# EAGLE schematic motordriver_4ch (EAGLE 6.5.0)
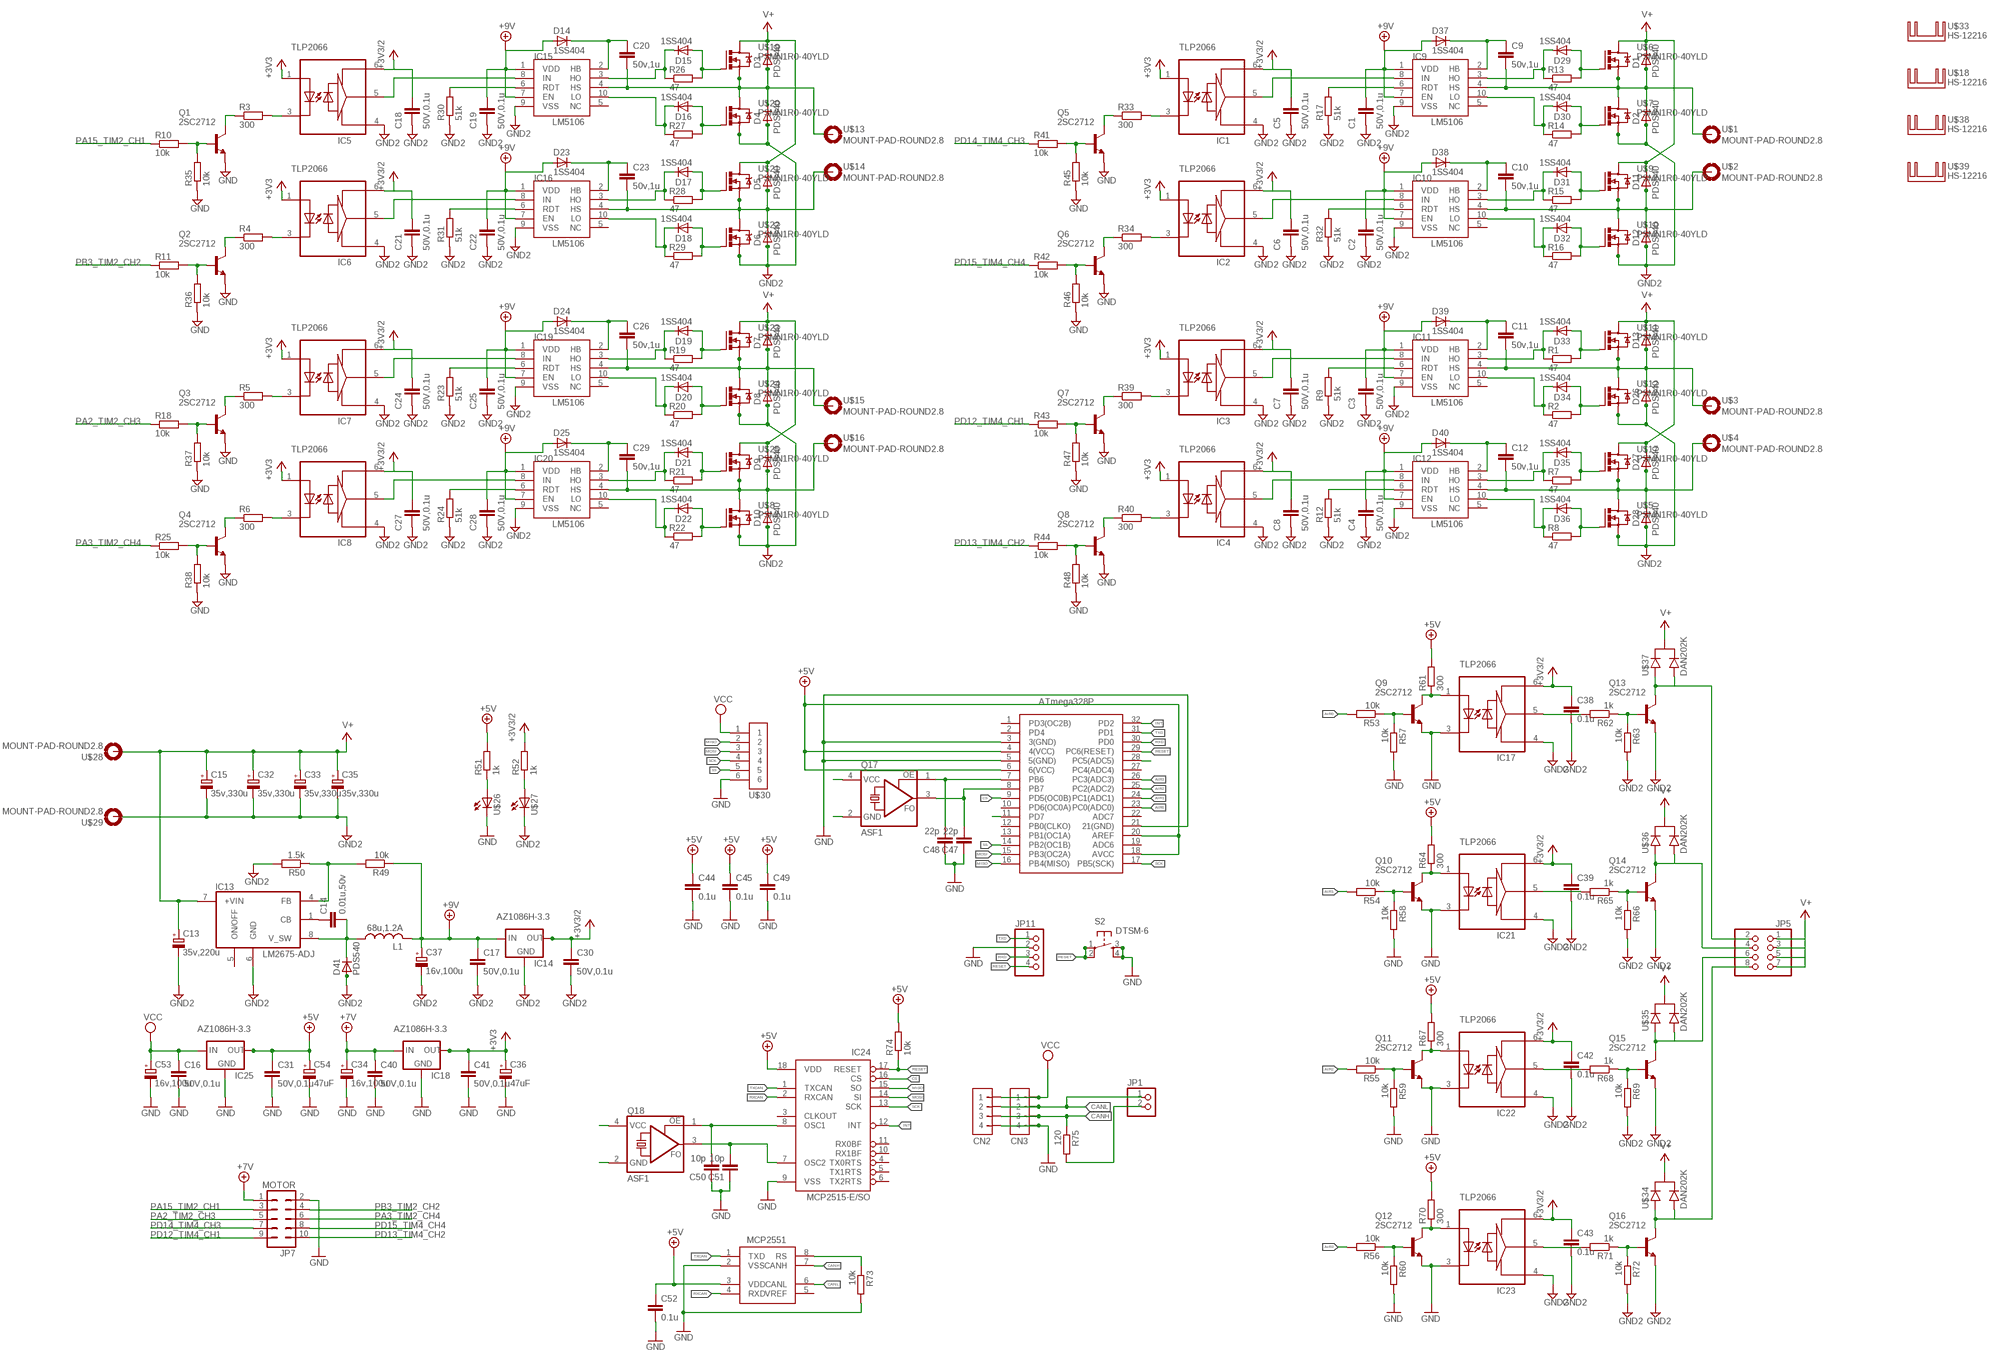
[diagram p0: schematic, sheet 1]

## Parts
C1  50V,0.1u  C-EUC0603  [C0603]
C2  50V,0.1u  C-EUC0603  [C0603]
C3  50V,0.1u  C-EUC0603  [C0603]
C4  50V,0.1u  C-EUC0603  [C0603]
C5  50V,0.1u  C-EUC0603  [C0603]
C6  50V,0.1u  C-EUC0603  [C0603]
C7  50V,0.1u  C-EUC0603  [C0603]
C8  50V,0.1u  C-EUC0603  [C0603]
C9  50v,1u  C-EUC0603  [C0603]
C10  50v,1u  C-EUC0603  [C0603]
C11  50v,1u  C-EUC0603  [C0603]
C12  50v,1u  C-EUC0603  [C0603]
C13  35v,220u  CPOL-EU153CLV-0810  [153CLV-0810]
C14  0.01u,50v  C-EUC0603  [C0603]
C15  35v,330u  CPOL-EU153CLV-1010  [153CLV-1010]
C16  50V,0.1u  C-EUC0603  [C0603]
C17  50V,0.1u  C-EUC0603  [C0603]
C18  50V,0.1u  C-EUC0603  [C0603]
C19  50V,0.1u  C-EUC0603  [C0603]
C20  50v,1u  C-EUC0603  [C0603]
C21  50V,0.1u  C-EUC0603  [C0603]
C22  50V,0.1u  C-EUC0603  [C0603]
C23  50v,1u  C-EUC0603  [C0603]
C24  50V,0.1u  C-EUC0603  [C0603]
C25  50V,0.1u  C-EUC0603  [C0603]
C26  50v,1u  C-EUC0603  [C0603]
C27  50V,0.1u  C-EUC0603  [C0603]
C28  50V,0.1u  C-EUC0603  [C0603]
C29  50v,1u  C-EUC0603  [C0603]
C30  50V,0.1u  C-EUC0603  [C0603]
C31  50V,0.1u  C-EUC0603  [C0603]
C32  35v,330u  CPOL-EU153CLV-1010  [153CLV-1010]
C33  35v,330u  CPOL-EU153CLV-1010  [153CLV-1010]
C34  16v,100u  CPOL-EU153CLV-0605  [153CLV-0605]
C35  35v,330u  CPOL-EU153CLV-1010  [153CLV-1010]
C36  47uF  CPOL-EU153CLV-0405  [153CLV-0405]
C37  16v,100u  CPOL-EU153CLV-0605  [153CLV-0605]
C38  0.1u  C-EUC0603  [C0603]
C39  0.1u  C-EUC0603  [C0603]
C40  50V,0.1u  C-EUC0603  [C0603]
C41  50V,0.1u  C-EUC0603  [C0603]
C42  0.1u  C-EUC0603  [C0603]
C43  0.1u  C-EUC0603  [C0603]
C44  0.1u  C-EUC0603K  [C0603K]
C45  0.1u  C-EUC0603K  [C0603K]
C47  22p  C-EUC0603K  [C0603K]
C48  22p  C-EUC0603K  [C0603K]
C49  0.1u  C-EUC0603K  [C0603K]
C50  10p  C-EUC0603K  [C0603K]
C51  10p  C-EUC0603K  [C0603K]
C52  0.1u  C-EUC0603K  [C0603K]
C53  16v,100u  CPOL-EU153CLV-0605  [153CLV-0605]
C54  47uF  CPOL-EU153CLV-0405  [153CLV-0405]
CN2  CN4-JST-XH-TOP  [JST-B4B-XH-A]
CN3  CN4-JST-XH-TOP  [JST-B4B-XH-A]
D1  PDS540  [POWER_DI_5]
D2  PDS540  [POWER_DI_5]
D3  PDS540  [POWER_DI_5]
D4  PDS540  [POWER_DI_5]
D5  PDS540  [POWER_DI_5]
D6  PDS540  [POWER_DI_5]
D7  PDS540  [POWER_DI_5]
D8  PDS540  [POWER_DI_5]
D9  PDS540  [POWER_DI_5]
D10  PDS540  [POWER_DI_5]
D11  PDS540  [POWER_DI_5]
D12  PDS540  [POWER_DI_5]
D13  PDS540  [POWER_DI_5]
D14  1SS404  [USC(1.25X2.5)]
D15  1SS404  [USC(1.25X2.5)]
D16  1SS404  [USC(1.25X2.5)]
D17  1SS404  [USC(1.25X2.5)]
D18  1SS404  [USC(1.25X2.5)]
D19  1SS404  [USC(1.25X2.5)]
D20  1SS404  [USC(1.25X2.5)]
D21  1SS404  [USC(1.25X2.5)]
D22  1SS404  [USC(1.25X2.5)]
D23  1SS404  [USC(1.25X2.5)]
D24  1SS404  [USC(1.25X2.5)]
D25  1SS404  [USC(1.25X2.5)]
D26  PDS540  [POWER_DI_5]
D27  PDS540  [POWER_DI_5]
D28  PDS540  [POWER_DI_5]
D29  1SS404  [USC(1.25X2.5)]
D30  1SS404  [USC(1.25X2.5)]
D31  1SS404  [USC(1.25X2.5)]
D32  1SS404  [USC(1.25X2.5)]
D33  1SS404  [USC(1.25X2.5)]
D34  1SS404  [USC(1.25X2.5)]
D35  1SS404  [USC(1.25X2.5)]
D36  1SS404  [USC(1.25X2.5)]
D37  1SS404  [USC(1.25X2.5)]
D38  1SS404  [USC(1.25X2.5)]
D39  1SS404  [USC(1.25X2.5)]
D40  1SS404  [USC(1.25X2.5)]
D41  PDS540  [POWER_DI_5]
IC1  TLP117  [MFSOP6]
IC2  TLP117  [MFSOP6]
IC3  TLP117  [MFSOP6]
IC4  TLP117  [MFSOP6]
IC5  TLP117  [MFSOP6]
IC6  TLP117  [MFSOP6]
IC7  TLP117  [MFSOP6]
IC8  TLP117  [MFSOP6]
IC9  LM5106  [MSOP10]
IC10  LM5106  [MSOP10]
IC11  LM5106  [MSOP10]
IC12  LM5106  [MSOP10]
IC13  LM2675-ADJ  LM2675  [SOP8-150]
IC14  LM1117MPX-5.0  LM1117  [SOT223]
IC15  LM5106  [MSOP10]
IC16  LM5106  [MSOP10]
IC17  TLP117  [MFSOP6]
IC18  LM1117MPX-5.0  LM1117  [SOT223]
IC19  LM5106  [MSOP10]
IC20  LM5106  [MSOP10]
IC21  TLP117  [MFSOP6]
IC22  TLP117  [MFSOP6]
IC23  TLP117  [MFSOP6]
IC24  MCP2515-E/SO  [SO18L]
IC25  LM1117MPX-5.0  LM1117  [SOT223]
JP1  PINHD-1X2  [1X02]
JP5  PINHD-2X4/90  [2X04/90]
JP7  MOTOR  ML10L  [ML10L]
JP11  PINHD-1X4  [1X04]
L1  68u,1.2A  SLF10145T  [SLF10145]
Q1  2SC2712  [SC-59(TYPE1)]
Q2  2SC2712  [SC-59(TYPE1)]
Q3  2SC2712  [SC-59(TYPE1)]
Q4  2SC2712  [SC-59(TYPE1)]
Q5  2SC2712  [SC-59(TYPE1)]
Q6  2SC2712  [SC-59(TYPE1)]
Q7  2SC2712  [SC-59(TYPE1)]
Q8  2SC2712  [SC-59(TYPE1)]
Q9  2SC2712  [SC-59(TYPE1)]
Q10  2SC2712  [SC-59(TYPE1)]
Q11  2SC2712  [SC-59(TYPE1)]
Q12  2SC2712  [SC-59(TYPE1)]
Q13  2SC2712  [SC-59(TYPE1)]
Q14  2SC2712  [SC-59(TYPE1)]
Q15  2SC2712  [SC-59(TYPE1)]
Q16  2SC2712  [SC-59(TYPE1)]
Q17  ASF1  [ASF]
Q18  ASF1  [ASF]
R1  47  R-EU_R0603  [R0603]
R2  47  R-EU_R0603  [R0603]
R3  300  R-EU_R0603  [R0603]
R4  300  R-EU_R0603  [R0603]
R5  300  R-EU_R0603  [R0603]
R6  300  R-EU_R0603  [R0603]
R7  47  R-EU_R0603  [R0603]
R8  47  R-EU_R0603  [R0603]
R9  51k  R-EU_R0603  [R0603]
R10  10k  R-EU_R0603  [R0603]
R11  10k  R-EU_R0603  [R0603]
R12  51k  R-EU_R0603  [R0603]
R13  47  R-EU_R0603  [R0603]
R14  47  R-EU_R0603  [R0603]
R15  47  R-EU_R0603  [R0603]
R16  47  R-EU_R0603  [R0603]
R17  51k  R-EU_R0603  [R0603]
R18  10k  R-EU_R0603  [R0603]
R19  47  R-EU_R0603  [R0603]
R20  47  R-EU_R0603  [R0603]
R21  47  R-EU_R0603  [R0603]
R22  47  R-EU_R0603  [R0603]
R23  51k  R-EU_R0603  [R0603]
R24  51k  R-EU_R0603  [R0603]
R25  10k  R-EU_R0603  [R0603]
R26  47  R-EU_R0603  [R0603]
R27  47  R-EU_R0603  [R0603]
R28  47  R-EU_R0603  [R0603]
R29  47  R-EU_R0603  [R0603]
R30  51k  R-EU_R0603  [R0603]
R31  51k  R-EU_R0603  [R0603]
R32  51k  R-EU_R0603  [R0603]
R33  300  R-EU_R0603  [R0603]
R34  300  R-EU_R0603  [R0603]
R35  10k  R-EU_R0603  [R0603]
R36  10k  R-EU_R0603  [R0603]
R37  10k  R-EU_R0603  [R0603]
R38  10k  R-EU_R0603  [R0603]
R39  300  R-EU_R0603  [R0603]
R40  300  R-EU_R0603  [R0603]
R41  10k  R-EU_R0603  [R0603]
R42  10k  R-EU_R0603  [R0603]
R43  10k  R-EU_R0603  [R0603]
R44  10k  R-EU_R0603  [R0603]
R45  10k  R-EU_R0603  [R0603]
R46  10k  R-EU_R0603  [R0603]
R47  10k  R-EU_R0603  [R0603]
R48  10k  R-EU_R0603  [R0603]
R49  10k  R-EU_R0603  [R0603]
R50  1.5k  R-EU_R0603  [R0603]
R51  1k  R-EU_R0603  [R0603]
R52  1k  R-EU_R0603  [R0603]
R53  10k  R-EU_R0603  [R0603]
R54  10k  R-EU_R0603  [R0603]
R55  10k  R-EU_R0603  [R0603]
R56  10k  R-EU_R0603  [R0603]
R57  10k  R-EU_R0603  [R0603]
R58  10k  R-EU_R0603  [R0603]
R59  10k  R-EU_R0603  [R0603]
R60  10k  R-EU_R0603  [R0603]
R61  300  R-EU_R0603  [R0603]
R62  1k  R-EU_R0603  [R0603]
R63  10k  R-EU_R0603  [R0603]
R64  300  R-EU_R0603  [R0603]
R65  1k  R-EU_R0603  [R0603]
R66  10k  R-EU_R0603  [R0603]
R67  300  R-EU_R0603  [R0603]
R68  1k  R-EU_R0603  [R0603]
R69  10k  R-EU_R0603  [R0603]
R70  300  R-EU_R0603  [R0603]
R71  1k  R-EU_R0603  [R0603]
R72  10k  R-EU_R0603  [R0603]
R73  10k  R-EU_R0603  [R0603]
R74  10k  R-EU_R0603  [R0603]
R75  120  R-EU_R0603  [R0603]
S2  DTSM-6  [DTSM-6]
U$1  MOUNT-PAD-ROUND2.8  [2,8-PAD]
U$2  MOUNT-PAD-ROUND2.8  [2,8-PAD]
U$3  MOUNT-PAD-ROUND2.8  [2,8-PAD]
U$4  MOUNT-PAD-ROUND2.8  [2,8-PAD]
U$5  PSMN1R0-40YLD  [LFPAK56]
U$6  PSMN1R0-40YLD  [LFPAK56]
U$7  PSMN1R0-40YLD  [LFPAK56]
U$8  PSMN1R0-40YLD  [LFPAK56]
U$9  PSMN1R0-40YLD  [LFPAK56]
U$10  PSMN1R0-40YLD  [LFPAK56]
U$11  PSMN1R0-40YLD  [LFPAK56]
U$12  PSMN1R0-40YLD  [LFPAK56]
U$13  MOUNT-PAD-ROUND2.8  [2,8-PAD]
U$14  MOUNT-PAD-ROUND2.8  [2,8-PAD]
U$15  MOUNT-PAD-ROUND2.8  [2,8-PAD]
U$16  MOUNT-PAD-ROUND2.8  [2,8-PAD]
U$17  PSMN1R0-40YLD  [LFPAK56]
U$18  HS-12216  [HS-12216]
U$19  PSMN1R0-40YLD  [LFPAK56]
U$20  PSMN1R0-40YLD  [LFPAK56]
U$21  PSMN1R0-40YLD  [LFPAK56]
U$22  PSMN1R0-40YLD  [LFPAK56]
U$23  PSMN1R0-40YLD  [LFPAK56]
U$24  PSMN1R0-40YLD  [LFPAK56]
U$25  PSMN1R0-40YLD  [LFPAK56]
U$26  0603  [0603]
U$27  0603  [0603]
U$28  MOUNT-PAD-ROUND2.8  [2,8-PAD]
U$29  MOUNT-PAD-ROUND2.8  [2,8-PAD]
U$30  CN6  [JST-B6B-XH-A]
U$31  ATMEGA328P  [TQFP]
U$32  MCP2551  [SOIC]
U$33  HS-12216  [HS-12216]
U$34  DAN202K  [SC-59]
U$35  DAN202K  [SC-59]
U$36  DAN202K  [SC-59]
U$37  DAN202K  [SC-59]
U$38  HS-12216  [HS-12216]
U$39  HS-12216  [HS-12216]

## Nets
3V3/2: C5.1 C6.1 C7.1 C8.1 C18.1 C21.1 C24.1 C27.1 C30.1 C38.1 C39.1 C42.1 C43.1 IC1.6(VCC) IC2.6(VCC) IC3.6(VCC) IC4.6(VCC) IC5.6(VCC) IC6.6(VCC) IC7.6(VCC) IC8.6(VCC) IC14.2(OUT1) IC14.4(OUT) IC17.6(VCC) IC21.6(VCC) IC22.6(VCC) IC23.6(VCC) R52.2 ; supply symbol labelled +3V3/2
+3V3: C36.+ C41.1 IC1.1 IC2.1 IC3.1 IC4.1 IC5.1 IC6.1 IC7.1 IC8.1 IC18.2(OUT1) IC18.4(OUT) ; supply symbol labelled +3V3/2
+5V: C31.1 C44.1 C45.1 C49.1 C52.1 C54.+ IC24.18(VDD) IC25.2(OUT1) IC25.4(OUT) R51.2 R61.2 R64.2 R67.2 R70.2 R74.2 U$31.4(4(VCC)) U$31.6(6(VCC)) U$31.18(AVCC) U$31.20(AREF) U$32.3(VDD)
+7V [VCC]: C34.+ C40.1 IC18.3(IN) JP7.1
+9V: C1.1 C2.1 C3.1 C4.1 C17.1 C19.1 C22.1 C25.1 C28.1 C37.+ D14.A D23.A D24.A D25.A D37.A D38.A D39.A D40.A IC9.1(VDD) IC9.7(EN) IC10.1(VDD) IC10.7(EN) IC11.1(VDD) IC11.7(EN) IC12.1(VDD) IC12.7(EN) IC14.3(IN) IC15.1(VDD) IC15.7(EN) IC16.1(VDD) IC16.7(EN) IC19.1(VDD) IC19.7(EN) IC20.1(VDD) IC20.7(EN) L1.P$2 R49.1
AIR0: R53.2 U$31.23(PC0(ADC0))
AIR1: R54.2 U$31.24(PC1(ADC1))
AIR2: R55.2 U$31.25(PC2(ADC2))
AIR3: R56.2 U$31.26(PC3(ADC3))
AIR5: U$31.28(PC5(ADC5))
CANH: CN2.3 CN3.3 R75.1 U$32.7(CANH)
CANL: CN2.2 CN3.2 JP1.1 U$32.6(CANL)
CS: IC24.16(CS) U$31.9(PD5(OC0B))
GND: C16.2 C31.2 C34.- C36.- C40.2 C41.2 C44.2 C45.2 C47.1 C48.1 C49.2 C50.1 C51.1 C52.2 C53.- C54.- CN2.4 CN3.4 IC17.3 IC18.1(GND) IC21.3 IC22.3 IC23.3 IC24.9(VSS) IC25.1(GND) JP7.2 JP11.2 Q1.E Q2.E Q3.E Q4.E Q5.E Q6.E Q7.E Q8.E Q9.E Q10.E Q11.E Q12.E R35.1 R36.1 R37.1 R38.1 R45.1 R46.1 R47.1 R48.1 R57.2 R58.2 R59.2 R60.2 R73.2 S2.3 S2.4 U$26.C U$30.6 U$31.3(3(GND)) U$31.5(5(GND)) U$31.21(21(GND)) U$32.2(VSS)
GND2: C1.2 C2.2 C3.2 C4.2 C5.2 C6.2 C7.2 C8.2 C13.- C15.- C17.2 C18.2 C19.2 C21.2 C22.2 C24.2 C25.2 C27.2 C28.2 C30.2 C32.- C33.- C35.- C37.- C38.2 C39.2 C42.2 C43.2 D2.A1 D2.A2(A) D4.A1 D4.A2(A) D6.A1 D6.A2(A) D8.A1 D8.A2(A) D10.A1 D10.A2(A) D12.A1 D12.A2(A) D26.A1 D26.A2(A) D28.A1 D28.A2(A) D41.A1 D41.A2(A) IC1.4(GND) IC2.4(GND) IC3.4(GND) IC4.4(GND) IC5.4(GND) IC6.4(GND) IC7.4(GND) IC8.4(GND) IC9.9(VSS) IC10.9(VSS) IC11.9(VSS) IC12.9(VSS) IC13.6(GND) IC14.1(GND) IC15.9(VSS) IC16.9(VSS) IC17.4(GND) IC19.9(VSS) IC20.9(VSS) IC21.4(GND) IC22.4(GND) IC23.4(GND) Q13.E Q14.E Q15.E Q16.E R9.1 R12.1 R17.1 R23.1 R24.1 R30.1 R31.1 R32.1 R50.2 R63.2 R66.2 R69.2 R72.2 U$5.1(S) U$5.2(S) U$5.3(S) U$7.1(S) U$7.2(S) U$7.3(S) U$8.1(S) U$8.2(S) U$8.3(S) U$10.1(S) U$10.2(S) U$10.3(S) U$12.1(S) U$12.2(S) U$12.3(S) U$20.1(S) U$20.2(S) U$20.3(S) U$22.1(S) U$22.2(S) U$22.3(S) U$24.1(S) U$24.2(S) U$24.3(S) U$27.C U$29.B2,8(MOUNT)
INT: IC24.12(INT) U$31.32(PD2)
MISO: IC24.15(SO) U$30.2 U$31.16(PB4(MISO))
MOSI: IC24.14(SI) U$30.3 U$31.15(PB3(OC2A))
N$1: C11.2 D13.A1 D13.A2(A) D26.K(C) IC11.4(HS) U$3.B2,8(MOUNT) U$11.1(S) U$11.2(S) U$11.3(S) U$12.5(D)
N$2: D33.A R1.2 U$11.4(G)
N$3: Q1.C R3.1
N$4: D34.A R2.2 U$12.4(G)
N$5: D36.A R8.2 U$5.4(G)
N$6: D35.A R7.2 U$17.4(G)
N$7: D33.K(C) IC11.3(HO) R1.1
N$8: D34.K(C) IC11.10(LO) R2.1
N$9: D35.K(C) IC12.3(HO) R7.1
N$10: D36.K(C) IC12.10(LO) R8.1
N$11: IC12.6(RDT) R12.2
N$12: IC5.5 IC15.8(IN)
N$13: IC6.5 IC16.8(IN)
N$14: C11.1 D39.K(C) IC11.2(HB)
N$15: C12.1 D40.K(C) IC12.2(HB)
N$16: IC7.5 IC19.8(IN)
N$17: C12.2 D27.A1 D27.A2(A) D28.K(C) IC12.4(HS) U$4.B2,8(MOUNT) U$5.5(D) U$17.1(S) U$17.2(S) U$17.3(S)
N$18: IC11.6(RDT) R9.2
N$19: IC8.5 IC20.8(IN)
N$20: C9.2 D1.A1 D1.A2(A) D2.K(C) IC9.4(HS) U$1.B2,8(MOUNT) U$6.1(S) U$6.2(S) U$6.3(S) U$7.5(D)
N$21: D29.A R13.2 U$6.4(G)
N$22: D30.A R14.2 U$7.4(G)
N$23: D32.A R16.2 U$10.4(G)
N$24: D31.A R15.2 U$9.4(G)
N$25: D29.K(C) IC9.3(HO) R13.1
N$26: D30.K(C) IC9.10(LO) R14.1
N$27: D31.K(C) IC10.3(HO) R15.1
N$28: D32.K(C) IC10.10(LO) R16.1
N$29: IC10.6(RDT) R32.2
N$30: C9.1 D37.K(C) IC9.2(HB)
N$31: C10.1 D38.K(C) IC10.2(HB)
N$32: IC9.6(RDT) R17.2
N$33: C10.2 D11.A1 D11.A2(A) D12.K(C) IC10.4(HS) U$2.B2,8(MOUNT) U$9.1(S) U$9.2(S) U$9.3(S) U$10.5(D)
N$34: IC1.5 IC9.8(IN)
N$35: IC2.5 IC10.8(IN)
N$36: IC3.5 IC11.8(IN)
N$37: IC4.5 IC12.8(IN)
N$38: Q5.C R33.1
N$39: IC1.3 R33.2
N$40: IC2.3 R34.2
N$41: Q6.C R34.1
N$42: IC3.3 R39.2
N$43: Q7.C R39.1
N$44: C26.2 D7.A1 D7.A2(A) D8.K(C) IC19.4(HS) U$15.B2,8(MOUNT) U$23.1(S) U$23.2(S) U$23.3(S) U$24.5(D)
N$45: IC4.3 R40.2
N$46: D19.A R19.2 U$23.4(G)
N$47: D20.A R20.2 U$24.4(G)
N$48: D22.A R22.2 U$8.4(G)
N$49: D21.A R21.2 U$25.4(G)
N$50: D19.K(C) IC19.3(HO) R19.1
N$51: D20.K(C) IC19.10(LO) R20.1
N$52: D21.K(C) IC20.3(HO) R21.1
N$53: D22.K(C) IC20.10(LO) R22.1
N$54: Q8.C R40.1
N$55: IC20.6(RDT) R24.2
N$56: Q5.B R41.2 R45.2
N$57: C26.1 D24.K(C) IC19.2(HB)
N$58: C29.1 D25.K(C) IC20.2(HB)
N$59: C29.2 D9.A1 D9.A2(A) D10.K(C) IC20.4(HS) U$8.5(D) U$16.B2,8(MOUNT) U$25.1(S) U$25.2(S) U$25.3(S)
N$60: Q6.B R42.2 R46.2
N$61: IC19.6(RDT) R23.2
N$62: C20.2 D3.A1 D3.A2(A) D4.K(C) IC15.4(HS) U$13.B2,8(MOUNT) U$19.1(S) U$19.2(S) U$19.3(S) U$20.5(D)
N$63: C23.2 D5.A1 D5.A2(A) D6.K(C) IC16.4(HS) U$14.B2,8(MOUNT) U$21.1(S) U$21.2(S) U$21.3(S) U$22.5(D)
N$64: D15.A R26.2 U$19.4(G)
N$65: D16.A R27.2 U$20.4(G)
N$66: D18.A R29.2 U$22.4(G)
N$67: D17.A R28.2 U$21.4(G)
N$68: D15.K(C) IC15.3(HO) R26.1
N$69: D16.K(C) IC15.10(LO) R27.1
N$70: D17.K(C) IC16.3(HO) R28.1
N$71: D18.K(C) IC16.10(LO) R29.1
N$72: Q7.B R43.2 R47.2
N$73: IC16.6(RDT) R31.2
N$74: Q8.B R44.2 R48.2
N$75: C20.1 D14.K(C) IC15.2(HB)
N$76: C23.1 D23.K(C) IC16.2(HB)
N$77: IC13.4(FB) R49.2 R50.1
N$78: R51.1 U$26.A
N$79: IC15.6(RDT) R30.2
N$80: IC5.3 R3.2
N$81: IC6.3 R4.2
N$82: Q2.C R4.1
N$83: C14.2 D41.K(C) IC13.8(V_SW) L1.P$1
N$84: IC7.3 R5.2
N$85: R52.1 U$27.A
N$86: C14.1 IC13.1(CB)
N$87: Q9.B R53.1 R57.1
N$88: Q10.B R54.1 R58.1
N$89: Q11.B R55.1 R59.1
N$90: Q12.B R56.1 R60.1
N$91: IC17.1 Q9.C R61.1
N$92: IC17.5 R62.2
N$93: Q3.C R5.1
N$94: IC8.3 R6.2
N$95: Q13.B R62.1 R63.1
N$96: JP5.2 Q13.C U$37.A@1(A1) U$37.A@2(A2)
N$97: IC21.5 R65.2
N$98: IC22.5 R68.2
N$99: IC23.5 R71.2
N$100: IC21.1 Q10.C R64.1
N$101: Q14.B R65.1 R66.1
N$102: JP5.4 Q14.C U$36.A@1(A1) U$36.A@2(A2)
N$103: Q4.C R6.1
N$104: IC22.1 Q11.C R67.1
N$105: Q15.B R68.1 R69.1
N$106: JP5.6 Q15.C U$35.A@1(A1) U$35.A@2(A2)
N$107: IC23.1 Q12.C R70.1
N$108: JP5.8 Q16.C U$34.A@1(A1) U$34.A@2(A2)
N$109: Q16.B R71.1 R72.1
N$110: C47.2 Q17.3(FO) U$31.8(PB7)
N$111: C48.2 Q17.1(OE) U$31.7(PB6)
N$112: R73.1 U$32.8(RS)
N$113: C50.2 IC24.8(OSC1) Q18.1(OE)
N$114: C51.2 IC24.7(OSC2) Q18.3(FO)
N$115: Q1.B R10.2 R35.2
N$116: Q2.B R11.2 R36.2
N$117: Q3.B R18.2 R37.2
N$118: Q4.B R25.2 R38.2
N$119: Q18.4(VCC)
N$120: Q18.2(GND)
N$121: JP1.2 R75.2
N$122: Q17.2(GND)
N$129: Q17.4(VCC)
PA2_TIM2_CH3: JP7.5 R18.1
PA3_TIM2_CH4: JP7.6 R25.1
PA15_TIM2_CH1: JP7.3 R10.1
PB3_TIM2_CH2: JP7.4 R11.1
PD12_TIM4_CH1: JP7.9 R43.1
PD13_TIM4_CH2: JP7.10 R44.1
PD14_TIM4_CH3: JP7.7 R41.1
PD15_TIM4_CH4: JP7.8 R42.1
RESET: IC24.17(RESET) JP11.4 R74.1 S2.1 S2.2 U$31.29(PC6(RESET))
RXCAN: IC24.2(RXCAN) U$32.4(RXD)
RXD: JP11.3 U$31.30(PD0)
SCK: IC24.13(SCK) U$30.4 U$31.17(PB5(SCK))
SS: U$30.5 U$31.14(PB2(OC1B))
SW2: U$31.11(PD7)
TXCAN: IC24.1(TXCAN) U$32.1(TXD)
TXD: JP11.1 U$31.31(PD1)
V+: C13.+ C15.+ C32.+ C33.+ C35.+ D1.K(C) D3.K(C) D5.K(C) D7.K(C) D9.K(C) D11.K(C) D13.K(C) D27.K(C) IC13.7(+VIN) JP5.1 JP5.3 JP5.5 JP5.7 U$6.5(D) U$9.5(D) U$11.5(D) U$17.5(D) U$19.5(D) U$21.5(D) U$23.5(D) U$25.5(D) U$28.B2,8(MOUNT) U$34.K U$35.K U$36.K U$37.K
VCC [VCC]: C16.1 C53.+ CN2.1 CN3.1 IC25.3(IN) U$30.1
Unconnected: IC9.5(NC) IC10.5(NC) IC11.5(NC) IC12.5(NC) IC13.5(ON/OFF) IC15.5(NC) IC16.5(NC) IC19.5(NC) IC20.5(NC) IC24.3(CLKOUT) IC24.4(TX0RTS) IC24.5(TX1RTS) IC24.6(TX2RTS) IC24.10(RX1BF) IC24.11(RX0BF) U$31.1(PD3(OC2B)) U$31.2(PD4) U$31.10(PD6(OC0A)) U$31.12(PB0(CLKO)) U$31.13(PB1(OC1A)) U$31.19(ADC6) U$31.22(ADC7) U$31.27(PC4(ADC4)) U$32.5(VREF)

## Notes on the sheet
- TLP2066 | TLP2066
- TLP2066 | TLP2066
- TLP2066 | TLP2066
- TLP2066 | TLP2066
- TLP2066
- TLP2066
- AZ1086H-3.3
- TLP2066
- AZ1086H-3.3 | AZ1086H-3.3
- TLP2066

## Library data of the parts
C1-C12 C14 C16-C31 C38-C45 C47-C52 = rcl:C-EU: CAPACITOR, European symbol
C13 C15 C32-C37 C53 C54 = rcl:CPOL-EU: POLARIZED CAPACITOR, European symbol
CN2 CN3 = con-jst_xh:CN4: Connector 4 circuits
D1-D13 D26-D28 D41 = Diode:PDS540
D14-D25 D29-D40 = Diode:1SS404
IC1-IC8 IC17 IC21-IC23 = PhotoCoupler:TLP117
IC9-IC12 IC15 IC16 IC19 IC20 = MotorDrivex:LM5106
IC13 = SwitchingRegulator:LM2675
IC14 IC18 IC25 = VoltageRegulator:LM1117
IC24 = mcp2515:MCP2515
JP1 = pinhead:PINHD-1X2: PIN HEADER
JP5 = pinhead:PINHD-2X4: PIN HEADER
JP7 = MIL-Conector:ML10L: HARTING
JP11 = pinhead:PINHD-1X4: PIN HEADER
L1 = Inductor:SLF10145T
Q1-Q16 = Transistor:2SC2712
Q17 Q18 = crystal:ASF*: CRYSTAL CLOCK OSCILLATORS 5.0 Vdc or 3.3 Vdc - LOW PROFILE ULTRA MINIATURE CERAMIC SURFACE MOUNT Source: http://www.abracon.com/Oscillators/asf1-L-L1.pdf; OC_FARNELL: unknown; OC_NEWARK: unknown
R1-R75 = rcl:R-EU_: RESISTOR, European symbol
S2 = switch-tact:DTSM-6
U$1-U$4 U$13-U$16 U$28 U$29 = holes:MOUNT-PAD-ROUND: MOUNTING PAD, round
U$5-U$12 U$17 U$19-U$25 = PSMN1R0-40YLD:PSMN1R0-40YLD
U$18 U$33 U$38 U$39 = heatsink2:HS-12216
U$26 U$27 = led_0603:0603
U$30 = con-jst_xh:CN6
U$31 = ATMEGA328P:ATMEGA328P
U$32 = MCP2551:MCP2551
U$34-U$37 = DAN202K:DAN202K